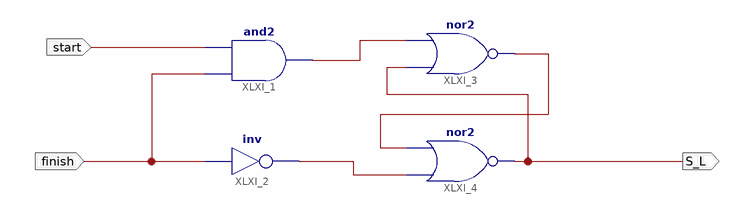
[diagram p0: schematic sheet 1]
// Xilinx ISE schematic SF.sch (kintex7) as structural Verilog: 4 symbols, 3 ports
module SF (
  input  start,
  input  finish,
  output S_L
);

  wire XLXN_4, XLXN_6, XLXN_7;

  and XLXI_1 (XLXN_4, finish, start);
  not XLXI_2 (XLXN_6, finish);
  nor XLXI_3 (XLXN_7, S_L, XLXN_4);
  nor XLXI_4 (S_L, XLXN_6, XLXN_7);
endmodule
